# EAGLE design PololuPCB_trial2 (EAGLE 8.3.2)
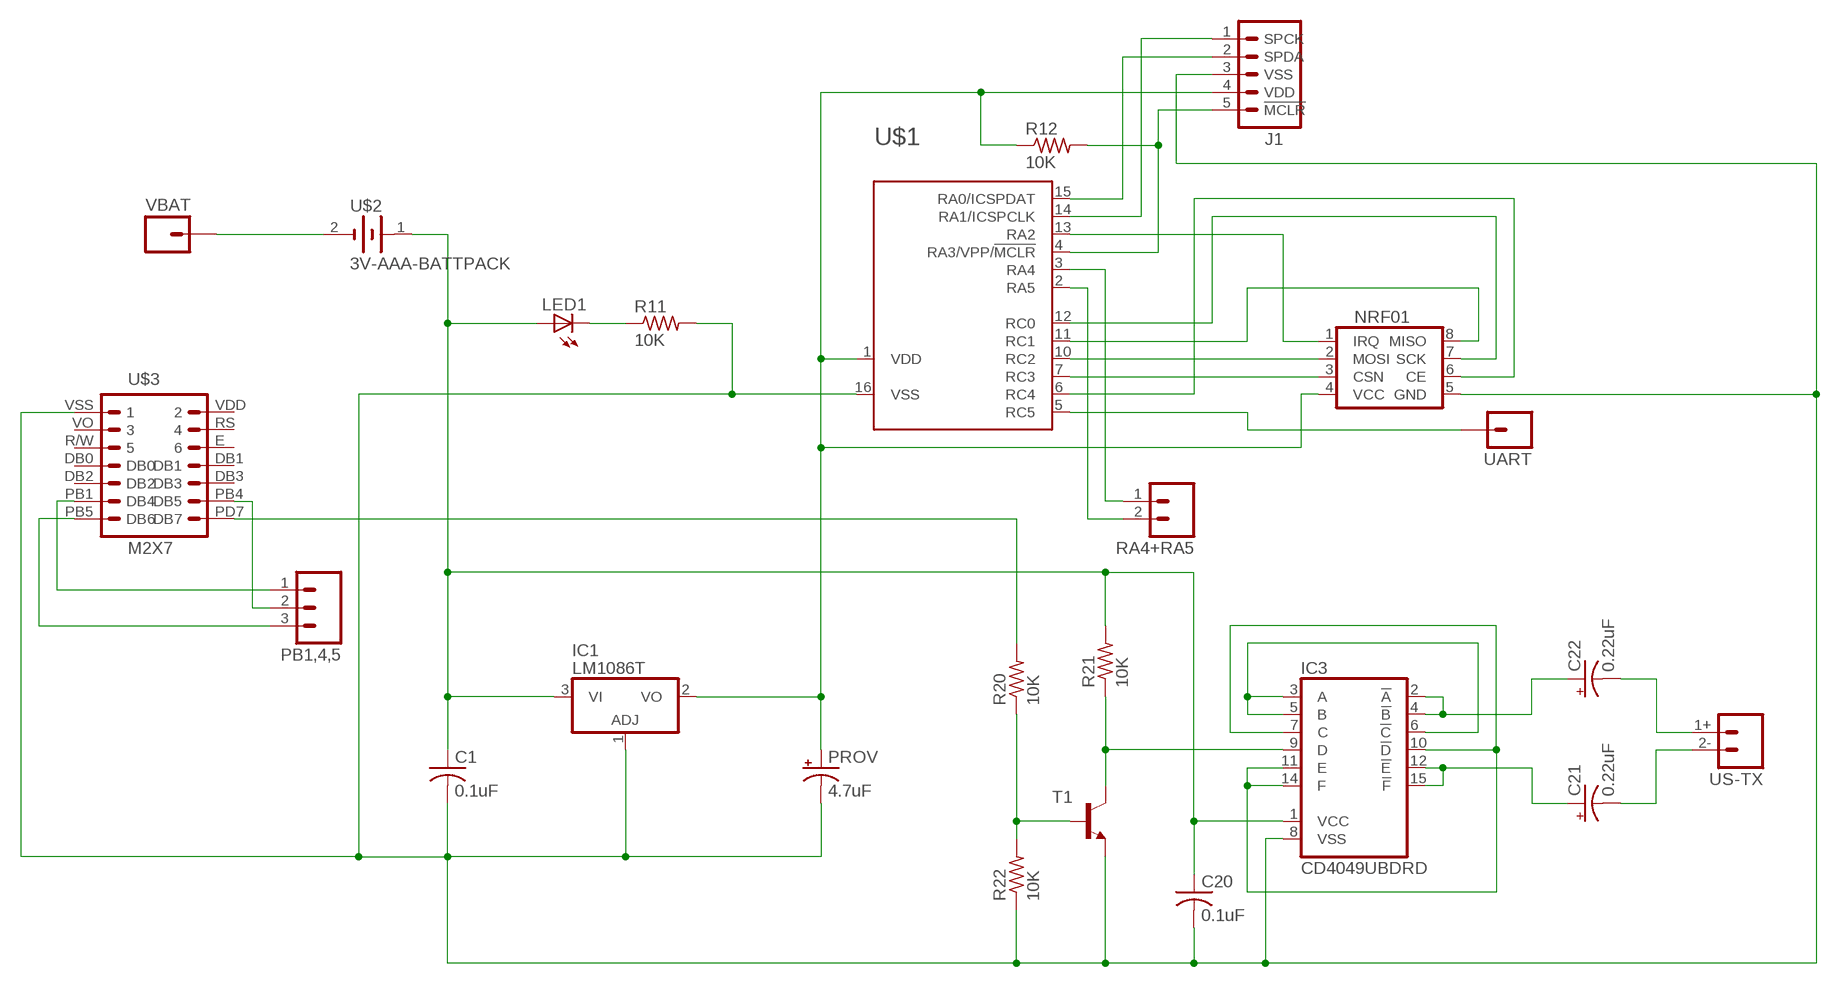
[diagram p0: schematic, sheet 1]

## Parts
C1  0.1uF  C-USC0805  [C0805]
C20  0.1uF  C-USC0805  [C0805]
C21  0.22uF  CPOL-USE2,5-6E  [E2,5-6E]
C22  0.22uF  CPOL-USE2,5-6E  [E2,5-6E]
IC1  LM1086T  [TO220H]
IC3  CD4049UBDRD  [SO16]
J1  M05PTH  [1X05]
LED1  LED5MM  [LED5MM]
NRF01  NRF01  [JP4Q]
PB1,4,5  M03PTH  [1X03]
PROV  4.7uF  CPOL-USE2,5-6E  [E2,5-6E]
R11  10K  R-US_R0805  [R0805]
R12  10K  R-US_R0805  [R0805]
R20  10K  R-US_R0805  [R0805]
R21  10K  R-US_R0805  [R0805]
R22  10K  R-US_R0805  [R0805]
RA4+RA5  M02PTH  [1X02]
T1  -NPN-SOT23-EBC  [SOT23-EBC]
U$1  PIC16F1503(DIL16)  [DIL16]
U$2  3V-AAA-BATTPACK  [3V-AAA-BATTPACK]
U$3  M2X7  [2X07]
UART  M01PTH_LONGPAD  [1X01_LONGPAD]
US-TX  M02UT-1640K-TT-2-R  [ULTRASONIC-PEIZO]
VBAT  M01PTH_LONGPAD  [1X01_LONGPAD]

## Nets
N$1: IC3.9(D) R21.1 T1.C
N$2: R20.2 U$3.PD7(DB7)
N$3: IC3.7(C) IC3.10(!D) IC3.11(E) IC3.14(F)
N$4: IC3.3(A) IC3.5(B) IC3.6(!C)
N$5: C22.+ IC3.2(!A) IC3.4(!B)
N$6: C1.2 C20.2 IC1.1(ADJ) IC3.8(VSS) J1.3(VSS) NRF01.5(GND) PROV.- R11.2 R22.1 T1.E U$1.16(VSS) U$3.VSS
N$7: C21.+ IC3.12(!E) IC3.15(!F)
N$8: R20.1 R22.2 T1.B
N$9: IC1.2(VO) J1.4(VDD) NRF01.4(VCC) PROV.+ R12.1 U$1.1(VDD)
N$11: NRF01.1(IRQ) U$1.13(RA2)
N$12: NRF01.8(MISO) U$1.11(RC1)
N$13: NRF01.3(CSN) U$1.7(RC3)
N$15: NRF01.6(CE) U$1.6(RC4)
N$16: NRF01.2(MOSI) U$1.10(RC2)
N$17: NRF01.7(SCK) U$1.12(RC0)
N$18: J1.2(SPDA) U$1.15(RA0/ICSPDAT)
N$19: J1.1(SPCK) U$1.14(RA1/ICSPCLK)
N$20: J1.5(!MCLR) R12.2 U$1.4(RA3/VPP/!MCLR)
N$21: LED1.K(C) R11.1
N$22: C22.- US-TX.1+
N$23: C21.- US-TX.2-
N$24: C1.1 C20.1 IC1.3(VI) IC3.1(VCC) LED1.A R21.2 U$2.1(+)
N$27: U$2.2(-) VBAT.1
N$28: U$1.5(RC5) UART.1
N$29: RA4+RA5.2 U$1.2(RA5)
N$30: RA4+RA5.1 U$1.3(RA4)
N$31: PB1,4,5.2 U$3.PB4(DB5)
N$32: PB1,4,5.1 U$3.PB1(DB4)
N$33: PB1,4,5.3 U$3.PB5(DB6)
Unconnected: U$3.DB0 U$3.DB1 U$3.DB2 U$3.DB3 U$3.E U$3.R/W U$3.RS U$3.VDD U$3.VO

## Library data of the parts
C1 C20 = rcl:C-US: CAPACITOR, American symbol
C21 C22 PROV = rcl:CPOL-US: POLARIZED CAPACITOR, American symbol
IC1 = gac_lib:LM1086: Positive VOLTAGE REGULATOR
IC3 = gac_lib:CD4049UBDR: Stored hex INVERTER/BUFFER
J1 = gac_lib:M05: Header 5 Standard 5-pin 0.1" header. Use with straight break away headers (SKU : PRT-00116), right angle break away headers (PRT-00553), swiss pins (PRT-00743), machine pins (PRT-00117), and female headers (PRT-00115). Molex polarized connector foot print use with SKU : PRT-08230 with associated crimp pins and housings.
LED1 = led:LED: LED OSRAM: - CHIPLED LG R971, LG N971, LY N971, LG Q971, LY Q971, LO R971, LY R971 LH N974, LH R974 LS Q976, LO Q976, LY Q976 LO Q996 - Hyper CHIPLED LW Q18S LB Q993, LB Q99A, LB R99A - SideLED LS A670, LO A670, LY A670, LG A670, LP A670 LB A673, LV A673, LT A673, LW A673 LH A674 LY A675 LS A676, LA A676, LO A676, LY A676, LW A676 LS A679, LY A679, LG A679 - Hyper Micro SIDELED® LS Y876, LA Y876, LO Y876, LY Y876 LT Y87S - SmartLED LW L88C, LW L88S LB L89C, LB L89S, LG L890 LS L89K, LO L89K, LY L89K LS L896, LA L896, LO L896, LY L896 - TOPLED LS T670, LO T670, LY T670, LG T670, LP T670 LSG T670, LSP T670, LSY T670, LOP T670, LYG T670 LG T671, LOG T671, LSG T671 LB T673, LV T673, LT T673, LW T673 LH T674 LS T676, LA T676, LO T676, LY T676, LB T676, LH T676, LSB T676, LW T676 LB T67C, LV T67C, LT T67C, LS T67K, LO T67K, LY T67K, LW E67C LS E67B, LA E67B, LO E67B, LY E67B, LB E67C, LV E67C, LT E67C LW T67C LS T679, LY T679, LG T679 LS T770, LO T770, LY T770, LG T770, LP T770 LB T773, LV T773, LT T773, LW T773 LH T774 LS E675, LA E675, LY E675, LS T675 LS T776, LA T776, LO T776, LY T776, LB T776 LHGB T686 LT T68C, LB T68C - Hyper Mini TOPLED® LB M676 - Mini TOPLED Santana® LG M470 LS M47K, LO M47K, LY M47K Source: http://www.osram.convergy.de LUXEON: - LUMILED® LXK2-PW12-R00, LXK2-PW12-S00, LXK2-PW14-U00, LXK2-PW14-V00 LXK2-PM12-R00, LXK2-PM12-S00, LXK2-PM14-U00 LXK2-PE12-Q00, LXK2-PE12-R00, LXK2-PE12-S00, LXK2-PE14-T00, LXK2-PE14-U00 LXK2-PB12-K00, LXK2-PB12-L00, LXK2-PB12-M00, LXK2-PB14-N00, LXK2-PB14-P00, LXK2-PB14-Q00 LXK2-PR12-L00, LXK2-PR12-M00, LXK2-PR14-Q00, LXK2-PR14-R00 LXK2-PD12-Q00, LXK2-PD12-R00, LXK2-PD12-S00 LXK2-PH12-R00, LXK2-PH12-S00 LXK2-PL12-P00, LXK2-PL12-Q00, LXK2-PL12-R00 Source: www.luxeon.com KINGBRIGHT: KA-3528ASYC Source: www.kingbright.com
NRF01 = gac_lib:NRF01: JUMPER
PB1,4,5 = SparkFun-Connectors:M03: Header 3 Standard 3-pin 0.1" header. Use with straight break away headers (SKU : PRT-00116), right angle break away headers (PRT-00553), swiss pins (PRT-00743), machine pins (PRT-00117), and female headers (PRT-00115). Molex polarized connector foot print use with SKU : PRT-08232 with associated crimp pins and housings.
R11 R12 R20-R22 = resistor:R-US_: RESISTOR, American symbol
RA4+RA5 = SparkFun-Connectors:M02: Standard 2-pin 0.1" header. Use with - straight break away headers ( PRT-00116) - right angle break away headers (PRT-00553) - swiss pins (PRT-00743) - machine pins (PRT-00117) - female headers (PRT-00115) Molex polarized connector foot print use with: PRT-08233 with associated crimp pins and housings. 2.54_SCREWTERM for use with PRT-10571. 3.5mm Screw Terminal footprints for PRT-08084 5mm Screw Terminal footprints for use with PRT-08432
T1 = transistor:*-NPN-: NPN Transistror BF959 corrected 2008.03.06
U$1 = gac_lib:PIC16F1503(DIL16)
U$2 = gac_lib:3V-AAA-BATTPACK
U$3 = gac_lib:M2X7
UART VBAT = SparkFun-Connectors:M01: Header 1 Standard 1-pin 0.1" header. Use with straight break away headers (SKU : PRT-00116), right angle break away headers (PRT-00553), swiss pins (PRT-00743), machine pins (PRT-00117), and female headers (PRT-00115). SMTSO-256-ET is a "flush mount" nut for a 4-40 screw. The older package used to be too tight, and did not allow it to sit properly thru the drill hit. The latest (0.165DIA) fits nice and snug.
US-TX = gac_lib:M02: Standard 2-pin 0.1" header. Use with - straight break away headers ( PRT-00116) - right angle break away headers (PRT-00553) - swiss pins (PRT-00743) - machine pins (PRT-00117) - female headers (PRT-00115) Molex polarized connector foot print use with: PRT-08233 with associated crimp pins and housings. 2.54_SCREWTERM for use with PRT-10571. 3.5mm Screw Terminal footprints for PRT-08084 5mm Screw Terminal footprints for use with PRT-08432

## Board
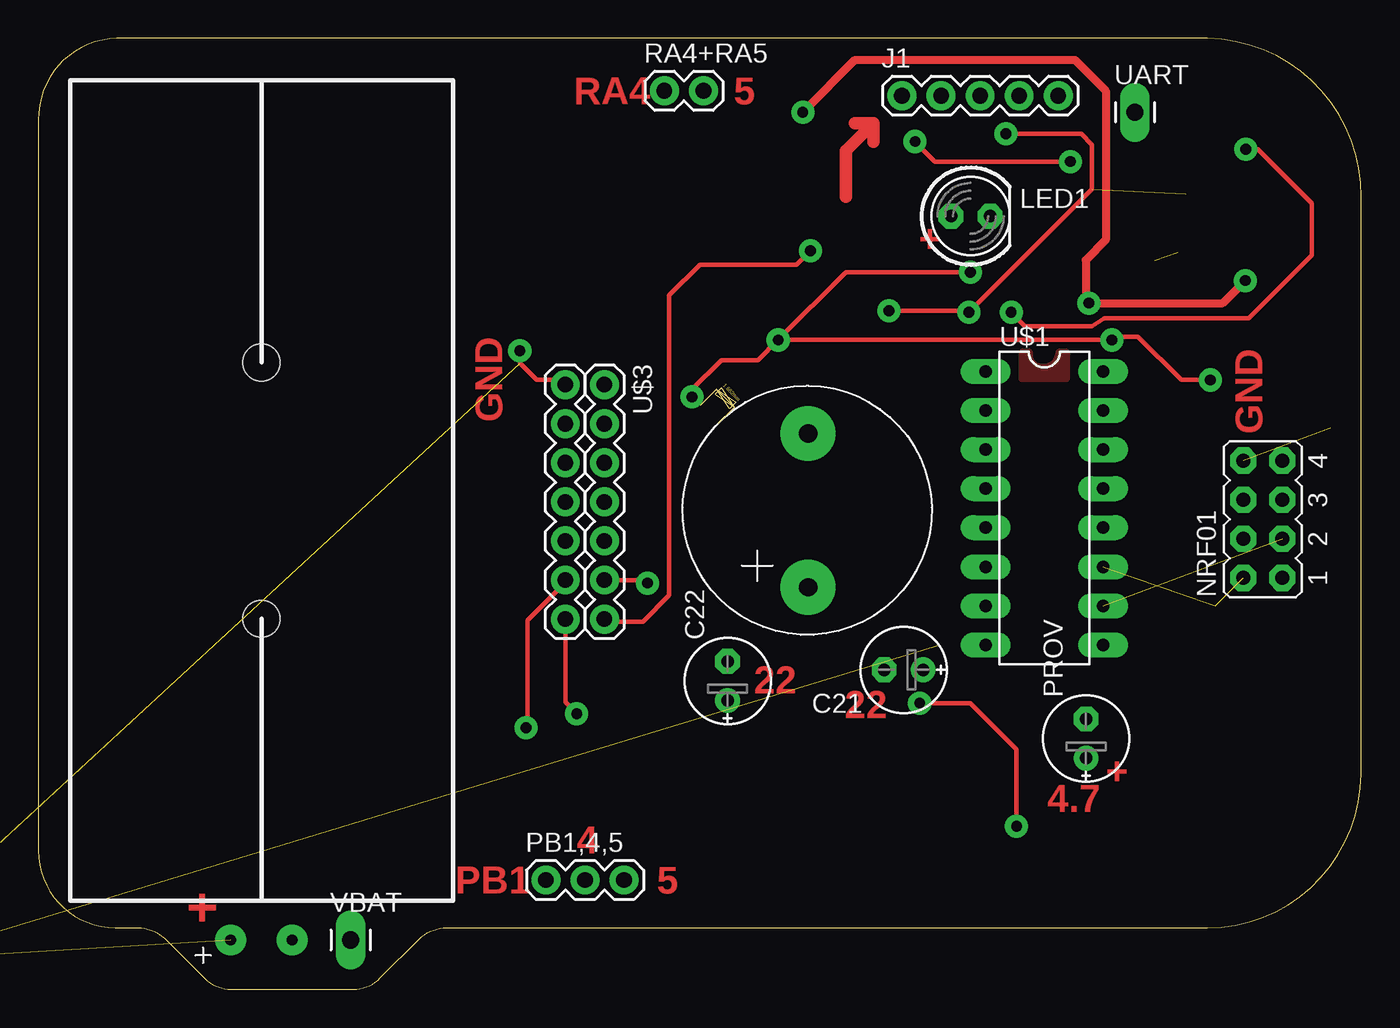
[diagram p1: board, top side]
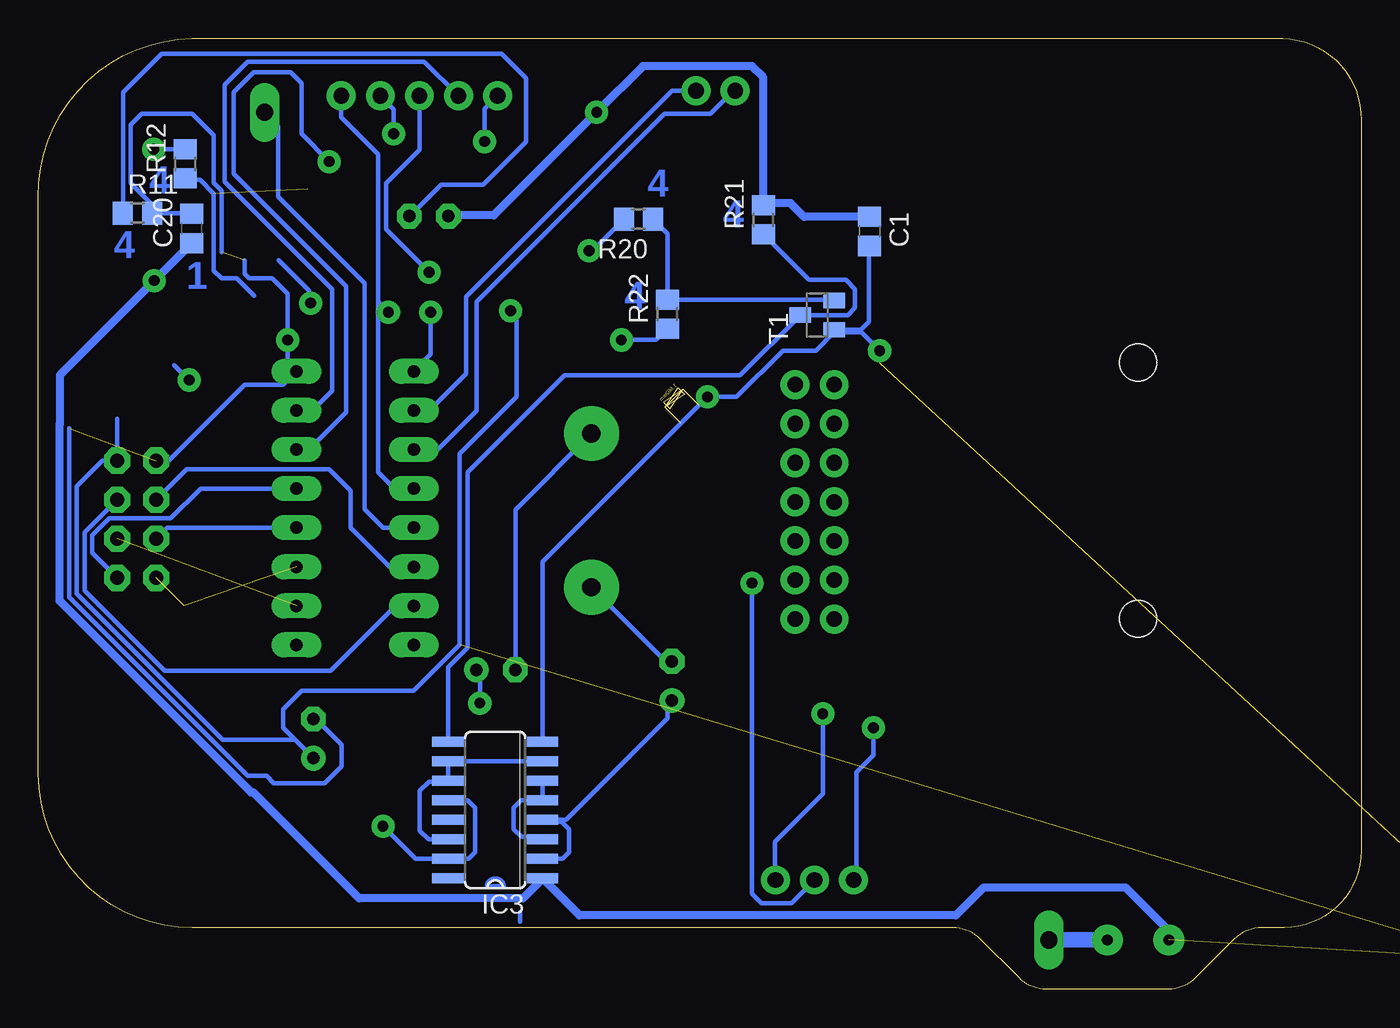
[diagram p2: board, bottom side, seen from below]

Size 86 x 61.8 mm. Coordinates in mm from the lower left corner, seen from the top.
Outline: 76,61.8 5.1,61.8 arc90 0,56.5 0,9 arc90 5,4 6.46,4 arc-45 8.23,3.27 10.77,0.73 arc45 12.54,0 20.46,0 arc45 22.23,0.73 24.77,3.27 arc-45 26.54,4 76,4 arc90 86,14 86,51.5 arc90 76,61.8
Copper layers (1*16): Top 0.06mm / dielectric 3mm / Bottom 0.06mm
Design rules "default *": minimum track width 0.3mm, minimum drill 0.35mm, track to track 0.2mm, track to pad 0.2mm, pad to pad 0.5mm, via to via 1mm, smd to smd 0mil, copper to edge 0.5mm, drill to drill 0.3mm, minimum pad ring 0.4mm, minimum via ring 0.4mm, stop-mask expansion 4mil, vias tented up to drill 0mil, thermal gap 10mil

### Footprints (pad centres in the part's own frame; a part is rotated, then mirrored left to right if it is on the bottom)
C0805 = smd 1.3 x 1.5: 1 -0.95,0; 2 0.95,0
E2,5-6E = drill 0.813 pad 1.575: + -1.27,0 | drill 0.813 pad 1.575 octagon: - 1.27,0
TO220H = drill 1.118 long: 1 -2.54,-10.16; 2 0,-10.16; 3 2.54,-10.16
SO16 = smd 0.66 x 2.032: 1 -4.445,-3.073; 2 -3.175,-3.073; 3 -1.905,-3.073; 4 -0.635,-3.073; 5 0.635,-3.073; 6 1.905,-3.073; 7 3.175,-3.073; 8 4.445,-3.073; 9 4.445,3.073; 10 3.175,3.073; 11 1.905,3.073; 12 0.635,3.073; 13 -0.635,3.073; 14 -1.905,3.073; 15 -3.175,3.073; 16 -4.445,3.073
1X05 = drill 1.016 pad 1.88: 1 0,0; 2 2.54,0; 3 5.08,0; 4 7.62,0; 5 10.16,0
LED5MM = drill 0.813 octagon: A -1.27,0; K 1.27,0
JP4Q = drill 0.914 octagon: 1 -3.81,-1.27; 2 -1.27,-1.27; 3 1.27,-1.27; 4 3.81,-1.27; 5 3.81,1.27; 6 1.27,1.27; 7 -1.27,1.27; 8 -3.81,1.27
1X03 = drill 1.016 pad 1.88: 1 0,0; 2 2.54,0; 3 5.08,0
R0805 = smd 1.3 x 1.5: 1 -0.95,0; 2 0.95,0
1X02 = drill 1.016 pad 1.88: 1 0,0; 2 2.54,0
SOT23-EBC = smd 1 x 1.4: B 0.95,-1.1; C 0,1.1; E -0.95,-1.1
DIL16 = drill 0.813 long: 1 -8.89,-3.81; 2 -6.35,-3.81; 3 -3.81,-3.81; 4 -1.27,-3.81; 5 1.27,-3.81; 6 3.81,-3.81; 7 6.35,-3.81; 8 8.89,-3.81; 9 8.89,3.81; 10 6.35,3.81; 11 3.81,3.81; 12 1.27,3.81; 13 -1.27,3.81; 14 -3.81,3.81; 15 -6.35,3.81; 16 -8.89,3.81
3V-AAA-BATTPACK = drill 0.7 pad 2: 1 0,-2; 2 0,2 | hole 2.388: -37.541,0; -20.879,0
2X07 = drill 1.016 pad 1.88: DB0 7.62,-2.54; DB1 7.62,0; DB2 10.16,-2.54; DB3 10.16,0; E 5.08,0; PB1 12.7,-2.54; PB4 12.7,0; PB5 15.24,-2.54; PD7 15.24,0; R/W 5.08,-2.54; RS 2.54,0; VDD 0,0; VO 2.54,-2.54; VSS 0,-2.54
1X01_LONGPAD = drill 1.118 pad 1.88 long: 1 0,0
ULTRASONIC-PEIZO = drill 1.2 pad 3.556: 1+ -5,0; 2- 5,0

### Placement (x,y rotation side)
C1  31.96,49.26 270 bottom
C20  76.03,49.45 90 bottom
C21  56.26,20.76 180 top
C22  44.81,20.04 90 top
IC1  -8,12.3 0 top  (outside the outline)
IC3  56.3,11.65 90 bottom
J1  56.15,58.08 0 top
LED1  60.61,50.25 0 top
NRF01  79.61,30.55 90 top
PB1,4,5  33,7.1 0 top
PROV  68.12,16.29 90 top
R11  79.57,50.44 0 bottom
R12  76.46,53.65 90 bottom
R20  46.98,50.05 180 bottom
R21  38.87,50.01 90 bottom
R22  45.1,43.88 90 bottom
RA4+RA5  40.7,58.4 0 top
T1  35.36,43.82 90 bottom
U$1  65.41,31.27 270 top
U$2  14.5,3.2 270 top
U$3  36.8,39.3 270 top
UART  71.3,57 0 top
US-TX  50.04,31.13 90 top
VBAT  20.3,3.2 0 top

### Tracks (layer width: path | path; a pad name or v marks a point on that pad's centre or on a via)
N$1
  Bottom 0.305: R21.1 35.91,46.1 33.5,46.1 32.9,45.5 32.9,44.3 33.38,43.82 T1.C 40.38,39.9 51.8,39.9 58.1,33.6 58.1,22.2 59.37,20.93 IC3.9
N$2  (via drill 0.7)
  Top 0.305: v50.2,48 49.3,47.1 43,47.1 41,45.1 41,25.6 39.3,23.9 36.96,23.9 U$3.PD7
  Bottom 0.305: v50.2,48 49.98,48 R20.2
N$3
  Bottom 0.305: 59.3,14.82 IC3.7 | 59.3,14.82 IC3.10 | IC3.14 60.65,9.75 61.2,10.3 61.2,12.9 60.6,13.5 59.43,13.5 IC3.11 59.37,14.75 59.3,14.82
N$4
  Bottom 0.305: IC3.6 IC3.5 54.62,12.29 55.1,11.8 55.1,10.4 54.6,9.9 53.38,9.9 IC3.3
N$5
  Bottom 0.305: IC3.2 51.92,8.47 51.5,8.9 51.5,10.4 52,10.9 53.11,10.9 IC3.4 51.69,11.02 45.1,17.6 45.1,18.48 C22.+
N$6  (via drill 0.7)  (3 unrouted)
  Top 0.305: v42.5,38.5 42.5,39 44.4,40.9 46.8,40.9 v48.1,42.2 | v48.1,42.2 v69.8,42.2 69.9,42.4 71.5,42.4 74.3,39.6 v76.2,39.6 | v60.6,46.6 52.5,46.6 v48.1,42.2 | v31.3,41.5 31.3,40.7 32.4,39.6 33.96,39.6 U$3.VSS
  Bottom 0.305: NRF01.5 77.54,34.36 72.6,39.3 70.08,39.3 69.24,40.14 | 69.24,40.14 U$1.16 | IC3.8 53.23,27.77 v42.5,38.5 40.6,38.5 37.6,41.5 35.46,41.5 34.26,42.7 | v48.1,42.2 45.83,42.2 R22.1 | 34.26,42.7 T1.E 32.53,42.87 32,43.4 32,48.27 C1.2 | 69.24,40.14 69.8,40.7 v69.8,42.2 69.8,45.2 70.8,46.2 72.3,46.2 72.6,46.5 72.6,47.37 | C20.2 76.07,50.44 R11.2 78.62,51.02 80,52.4 80,56.2 79.3,56.9 76,56.9 74.6,55.5 74.6,52.41 74.09,51.91 74.09,47.91 | 77.16,40.56 v76.2,39.6 | J1.3 61.23,54.57 63.4,52.41 63.4,49.4 v60.6,46.6 | 34.26,42.7 32.5,42.7 v31.3,41.5 | PROV.- 67.96,17.56 66.3,15.9 66.3,14.5 67.4,13.4 70.7,13.4 71.16,13.86 72.39,13.86 84.01,25.49 84.01,36.48
N$7  (via drill 0.7)
  Top 0.305: v63.6,10.6 63.6,15.6 60.6,18.6 v57.3,18.6
  Bottom 0.305: IC3.12 59.36,12.3 58.1,12.3 57.6,11.8 57.6,8.9 58.02,8.47 IC3.15 61.48,8.47 v63.6,10.6 | v57.3,18.6 57.3,20.53 C21.+
N$8
  Bottom 0.305: R20.1 45.1,49.12 R22.2 34.32,44.83 T1.B
N$9  (via drill 0.7)  (2 unrouted)
  Top 0.305: v55.3,44.1 60.7,44.1 v60.5,44 68.5,52 68.5,54.9 67.8,55.6 v62.9,55.6
  Bottom 0.305: PROV.+ 69.3,16.2 | 80.88,37.08 NRF01.4 81.84,34.36 83.5,32.7 83.5,29.93 83.51,29.92 83.51,25.7 74.01,16.2 69.3,16.2 | 71.98,45.08 73.1,46.2 74.1,46.2 74.6,46.7 74.6,51.7 75.5,52.6 76.36,52.6 R12.1 | 69.3,16.2 70.1,17 70.1,18.2 68.9,19.4 61.6,19.4 59.88,21.12 59.88,21.14 58.61,22.41 58.61,34.79 54.9,38.5 54.9,43.7 v55.3,44.1 | v60.5,44 60.5,41.26 U$1.1 | v62.9,55.6 62.9,57.21 J1.4
N$11
  Bottom 0.305: U$1.13 75.46,32.54 77.4,30.6 81.4,30.6 82.5,29.5 82.5,28.36 NRF01.1
N$12  (2 unrouted)
N$13
  Bottom 0.305: U$1.7 62.78,24.92 67,20.7 77.8,20.7 83,25.91 83,29.71 81.61,31.11 81.59,31.11 NRF01.3
N$15
  Bottom 0.305: U$1.6 63.16,27.46 65.7,30 65.7,32.4 67.1,33.8 76.36,33.8 NRF01.6
N$16  (1 unrouted)
N$17
  Bottom 0.305: U$1.12 77.62,30 NRF01.7
N$18
  Bottom 0.305: U$1.15 68.18,37.62 66.9,38.9 66.9,45.5 73.9,52.5 73.9,58.8 72.4,60.3 60.91,60.3 J1.2
N$19  (via drill 0.7)
  Top 0.305: v67.1,53.8 58.3,53.8 v57,55.1
  Bottom 0.305: U$1.14 68.42,35.08 66,37.5 66,45.7 73.3,53 73.3,58.3 72,59.6 69.6,59.6 68.9,58.9 68.9,55.6 v67.1,53.8 | v57,55.1 57,57.23 J1.1
N$20  (via drill 0.7)
  Top 0.305: v78.5,54.6 79.3,54.6 82.8,51.1 82.8,47.7 78.7,43.6 69.3,43.6 68.5,43.1 64.15,43.1 v63.25,44
  Bottom 0.305: U$1.4 62.84,32.54 63.9,33.6 63.9,44.7 | 63.9,44.7 63.9,54.27 66.31,56.68 J1.5 | R12.2 v78.5,54.6 | v63.25,44 63.2,44 63.9,44.7
N$21
  Bottom 0.305: LED1.K 59.83,52.3 57.1,52.3 54.3,55.1 54.3,59.2 55.9,60.8 57.04,60.8 57.05,60.8 78,60.8 80.5,58.3 80.5,50.46 R11.1
N$22
  Bottom 0.305: C22.- 45.22,21.31 US-TX.1+
N$23
  Bottom 0.305: C21.- 54.99,31.18 US-TX.2-
N$24  (via drill 0.7)  (1 unrouted)
  Top 0.508: v78.47,46.06 77,44.6 v68.3,44.6 68.1,44.4 68.1,47.4 69.4,48.7 69.4,58.4 67.4,60.4 53.1,60.4 v49.7,57
  Bottom 0.305: IC3.1 53.23,7.17 | 38.73,51.1 R21.2 | 59.29,50.3 LED1.A | 70.38,47.38 68.4,45.4 68.4,44.5 v68.3,44.6
  Bottom 0.508: U$2.1 12.5,3.8 15.3,6.6 24.56,6.6 26.36,4.8 50.82,4.8 IC3.1 | 53.23,7.17 54.5,5.9 65.14,5.9 72.03,12.79 72.18,12.79 84.62,25.23 84.62,36.73 84.6,36.75 84.6,39.93 v78.47,46.06 C20.1 | C1.1 36.21,50.21 37.1,51.1 38.73,51.1 | R21.2 38.87,59.27 39.6,60 46.7,60 v49.7,57 56.4,50.3 59.29,50.3
N$25
  Top 0.813: 52.5,51.5 52.5,54.5 54.3,56.3 53.1,56.3
N$26
  Top 0.813: 54.3,56.2 54.3,55.1
N$27
  Bottom 1.016: VBAT.1 U$2.2
N$28
  Bottom 0.305: U$1.5 63.6,30 64.8,31.2 64.8,45.9 70.4,51.5 70.4,56.1 UART.1
N$29
  Bottom 0.305: U$1.2 60.58,37.62 58.2,40 58.2,45 44.8,58.4 RA4+RA5.2
N$30
  Bottom 0.305: RA4+RA5.1 40.8,58.4 42.3,56.9 45.3,56.9 57.5,44.7 57.5,37.6 60,35.1 61.58,35.1 U$1.3
N$31  (via drill 0.7)
  Top 0.305: U$3.PB4 39.4,26.6 v39.6,26.4
  Bottom 0.305: 35.54,6.56 PB1,4,5.2 37.04,5.6 39,5.6 39.6,6.2 v39.6,26.4
N$32  (via drill 0.7)
  Top 0.305: v31.7,17 31.8,17.1 31.8,24 34.26,26.46 U$3.PB1
  Bottom 0.305: PB1,4,5.1 32.8,6.8 32.8,14.1 31.7,15.2 v31.7,17
N$33  (via drill 0.7)
  Top 0.305: v35,17.9 34.26,18.64 U$3.PB5
  Bottom 0.305: PB1,4,5.3 38.1,6.62 38.1,9.6 35,12.7 v35,17.9
N$34
  pour Top: 64.4,41.4 64.4,41.2 arc90 65.2,40.4 65.4,40.4 arc90 66.4,41.4 66.8,41.4 66.8,39.7 64,39.7 64,41.4
N$35
  Bottom 0.305: 54.7,5 54.7,4.4
N$36
  Bottom 0.305: 55.74,6.68 arc-90 56.24,7.18 56.34,7.18 arc-90 56.84,6.68 55.74,6.68

### Text on the board
Top: RA4 | 5 | + | GND | GND | 22 | 22 | + | 4.7 | 4 | PB1 | 5 | +
Bottom: 4 | 4 | 4 | 4 | 1 | 4